# Altium schematic sheet Power_HUMA-mini.SchDoc
size A4
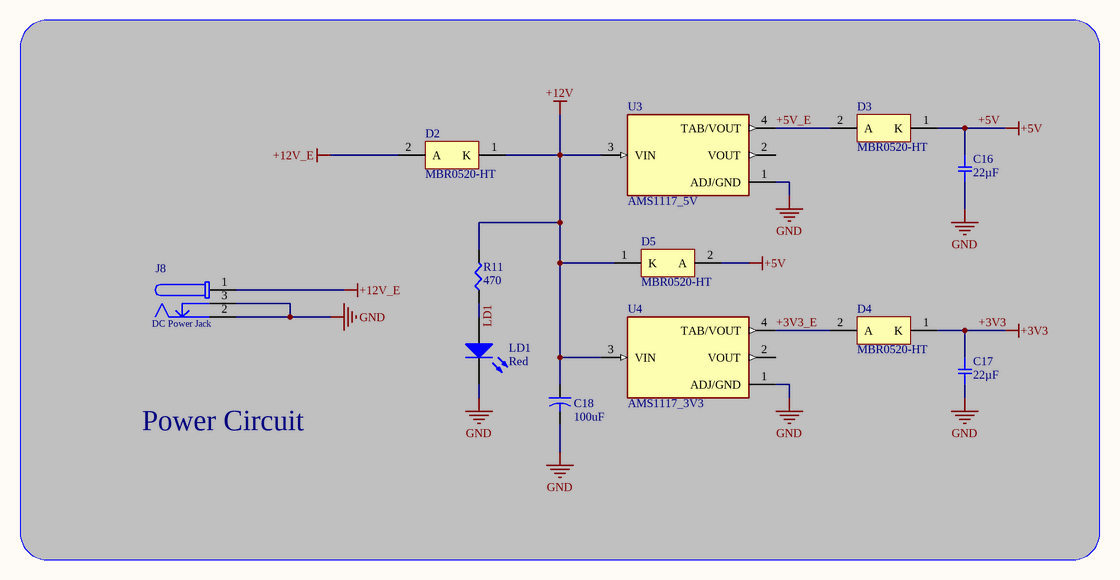
[diagram p0: Power_HUMA-mini.SchDoc]

## Parts
C16  22µF  [SMD-1206C]
C17  22µF  [SMD-1206C]
C18  value 100uF  [CAPR5-4X5]  (hidden comment: Cap2)
D2  MBR0520-HT  [ONSC-SOD-123-2-425-04_V]
D3  MBR0520-HT  [ONSC-SOD-123-2-425-04_V]
D4  MBR0520-HT  [ONSC-SOD-123-2-425-04_V]
D5  MBR0520-HT  [ONSC-SOD-123-2-425-04_V]
J8  DC Power Jack  [694106301002]
LD1  Red  [Type 3mm]
R11  470  [SMD-0805-RES]
U3  AMS1117_5V  [*SOT229P700X180-4N]
U4  AMS1117_3V3  [*SOT229P700X180-4N]

## Blocks framed on the sheet
Power Circuit: C16-C18 D2-D5 J8 LD1 R11 U3 U4

## Nets
+3V3: C17.1 D4.1(K)
+5V: C16.1 D3.1(K) D5.2(A)
+12V: C18.1 D2.1(K) D5.1(K) R11.2 U3.3(VIN) U4.3(VIN)
+12V_E: D2.2(A) J8.1
GND: C16.2 C17.2 C18.2 J8.2 J8.3 LD1.1(K) U3.1(ADJ/GND) U4.1(ADJ/GND)
+3V3_E: D4.2(A) U4.4(TAB/VOUT)
+5V_E: D3.2(A) U3.4(TAB/VOUT)
LD1: LD1.2(A) R11.1

Not connected (* = marked no-connect by the designer): U3 2(VOUT); U4 2(VOUT)

## Library data of the parts
C16 C17 = GRM31CR71A226ME15L: CAP CER 22UF 10V X7R 1206; Manufacturer: Murata Electronics North America; Factory Stock: 0; Unit Price (USD): 0.51; Minimum Quantity: 1; Tolerance: ±20%; Datasheets: http://www.murata.com/~/media/webrenewal/support/library/catalog/products/capacitor/mlcc/c02e.pdf; Image: //media.digikey.com/Renders/Murata%20Renders/GR331BD72E473KW01L.jpg; Digi-Key Part Number: 490-6516-1-ND; Part Number: GRM31CR71A226ME15L; Quantity Available: 107; @ qty: 0; Packaging: Cut Tape (CT); Series: GRM; Part Status: Active; Value: 22µF; Voltage: 10V; Temperature Coefficient: X7R; Operating Temperature: -55°C ~ 125°C; Features: -; Ratings: -; Applications: General Purpose; Mounting Type: Surface Mount, MLCC; Package / Case: 1206 (3216 Metric); Size / Dimension: 0.126" L x 0.063" W (3.20mm x 1.60mm); Height - Seated (Max): -; Thickness (Max): 0.071" (1.80mm); Lead Spacing: -; Lead Style: -
C18 = Cap2: Capacitor; Published: 23-Sep-2002; PackageReference: CAPR5-4X5; Publisher: Altium Limited; PackageDescription: Capacitor; 2 Leads
D2-D5 = MBR0520LT1: 20V 0.5A Schottky Power Rectifier, 2-Pin SOD-123, Tape and Reel; Manufacturer: On Semiconductor; Configuration: Single; IFSM Max (A): 5.5; DatasheetVersion: Rev. 6; PackageVersion: Rev. G, 10/2009; PackageReference: SOD-123-2-425-04; PackageDescription: 2-Pin SOD, Body 1.6 x 2.69 mm; Supplier 1: Digi-Key; Supplier Part Number 1: MBR0520LT1OSCT-ND; Packing: Tape and Reel; RoHS: FALSE; Mounting Technology: Surface Mount; PartNumber: MBR0520LT1; ComponentLink1Description: Manufacturer URL; ComponentLink1URL: http://www.onsemi.com/; ComponentLink2Description: Datasheet; ComponentLink2URL: http://www.onsemi.cn/pub_link/Collateral/MBR0520LT1-D.PDF; ComponentLink3Description: Package Specification; ComponentLink3URL: http://www.onsemi.com/pub_link/Collateral/425-04.PDF
J8 = 694106301002: DC Power Jack Connector WR-DC, Male, Right Angled, THT, 5 A, 24 V; Opening Diameter: 6.4 mm; Plug Inner Diameter: 2.05 mm; Plug Outer Diameter: 5.5 mm; Rated Current: 5 A; Working Voltage: 24 V; ComponentLink1Description: Manufacturer; ComponentLink1URL: http://www.we-online.de; ComponentLink2Description: Datasheet; ComponentLink2URL: http://katalog.we-online.de/em/datasheet/6941xx301002.pdf; Part Number: 694106301002; Published Date: August 2018; Publisher: Wurth Elektronik; Orientation: Right Angled; Operating Temperature: -40 to 85 degC; Mounting Technology: THT; Gender: Male; Packaging: Bag
LD1 = 151033RS03000: THT LED round mono-color waterclear, WL-TMRW, Red; PackageReference: Type 3mm; Emitting color: Red; PartNumber: 151033RS03000; ComponentLink1Description: Manufacturer URL; ComponentLink1URL: http://www.we-online.com; ComponentLink2Description: Datasheet; ComponentLink2URL: http://katalog.we-online.de/pbs/datasheet/7448042001.pdfhttp://katalog.we-online.de/pbs/datasheet/7448042001.pdfhttp://katalog.we-online.de/pbs/datasheet/7448042001.pdfhttp://katalog.we-online.de/pbs/datasheet/151033RS03000.pdf
R11 = ERJ-P6WJ471V: RES SMD 470 OHM 5% 1/2W 0805; Manufacturer: Panasonic Electronic Components; Factory Stock: 0; Unit Price (USD): 0.08237; @ qty: 1500; Minimum Quantity: 1; Power (Watts): 0.5W, 1/2W; Temperature Coefficient: ±200ppm/°C; Part Number: ERJ-P6WJ471V; Datasheets: https://industrial.panasonic.com/cdbs/www-data/pdf/RDA0000/AOA0000C243.pdf; Image: //media.digikey.com/Renders/Panasonic%20Renders/ERJ-0805%20Pkg.jpg; Digi-Key Part Number: P16950CT-ND; Quantity Available: 4195; Packaging: Cut Tape (CT); Series: ERJ; Part Status: Active; Value: 470; Tolerance: ±5%; Composition: Thick Film; Features: Automotive AEC-Q200, Pulse Withstanding; Operating Temperature: -55°C ~ 155°C; Package / Case: 0805 (2012 Metric); Supplier Device Package: 0805; Size / Dimension: 0.079" L x 0.049" W (2.00mm x 1.25mm); Height - Seated (Max): 0.030" (0.75mm); Number of Terminations: 2; Failure Rate: -
U3 U4 = AMS1117: Sot223/Pkg 1-Amp Low Drop Out Voltage Regulator; MF: Advanced Monolithic Systems; MP: AMS1117-3.3; Package: None; Price: None; Availability: Unavailable; SnapEDA_Link: https://www.snapeda.com/parts/AMS1117-3.3/Advanced%20Monolithic%20Systems/view-part/53450/?ref=snap; Value: *